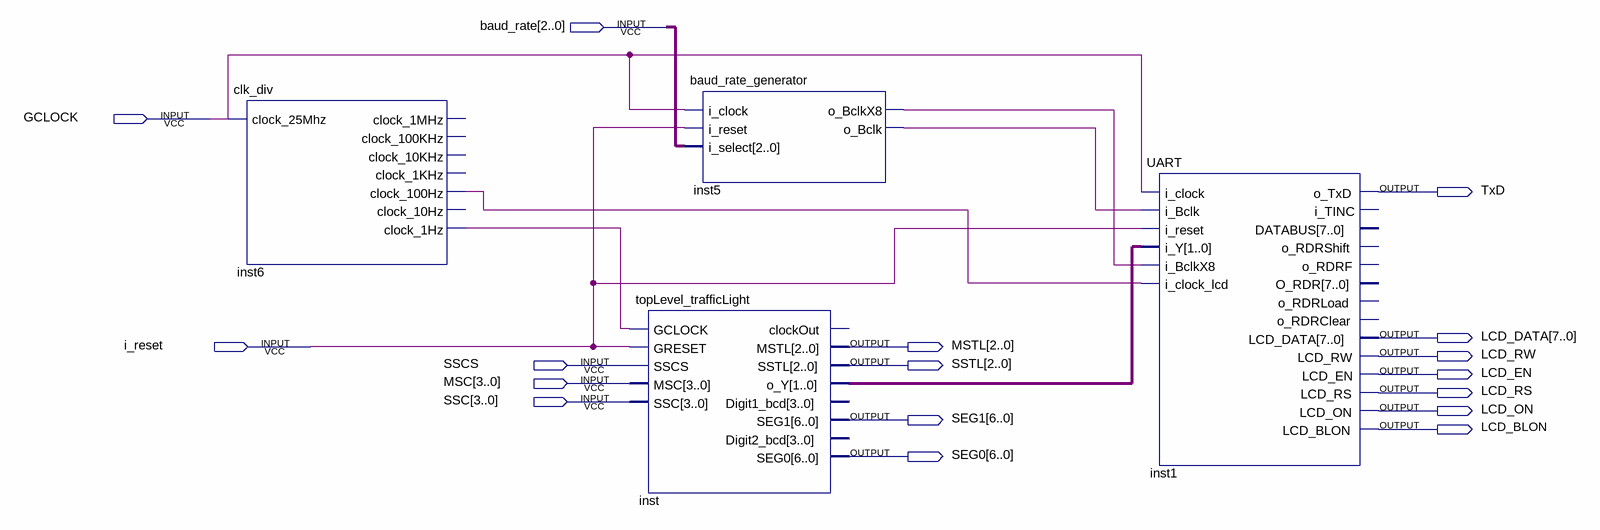
[diagram p0: schematic sheet]
// Quartus schematic top.bdf as structural Verilog: 4 symbols, 17 pins
module top (
  input  [2:0] baud_rate,
  input  GCLOCK,
  input  i_reset,
  input  SSCS,
  input  [3:0] MSC,
  input  [3:0] SSC,
  output TxD,
  output [7:0] LCD_DATA,
  output [2:0] MSTL,
  output LCD_RW,
  output [2:0] SSTL,
  output LCD_EN,
  output LCD_RS,
  output LCD_ON,
  output [6:0] SEG1,
  output LCD_BLON,
  output [6:0] SEG0
);

  wire inst5_o_bclk, inst5_o_bclkx8, inst6_clock_1hz, inst6_clock_100hz;
  wire [1:0] inst_o_y;

  clk_div inst6 (
    .clock_25Mhz(GCLOCK), .clock_100Hz(inst6_clock_100hz), .clock_1Hz(inst6_clock_1hz));  // open: clock_1MHz, clock_100KHz, clock_10KHz, clock_1KHz, clock_10Hz
  topLevel_trafficLight inst (
    .GCLOCK(inst6_clock_1hz), .GRESET(i_reset), .SSCS(SSCS), .MSC(MSC), .SSC(SSC), .MSTL(MSTL), .SSTL(SSTL),
    .o_Y(inst_o_y), .SEG1(SEG1), .SEG0(SEG0));  // open: clockOut, Digit1_bcd, Digit2_bcd
  baud_rate_generator inst5 (
    .i_clock(GCLOCK), .i_reset(i_reset), .i_select(baud_rate), .o_BclkX8(inst5_o_bclkx8),
    .o_Bclk(inst5_o_bclk));
  UART inst1 (
    .i_clock(GCLOCK), .i_Bclk(inst5_o_bclk), .i_reset(i_reset), .i_Y(inst_o_y), .i_BclkX8(inst5_o_bclkx8),
    .i_clock_lcd(inst6_clock_100hz), .o_TxD(TxD), .LCD_DATA(LCD_DATA), .LCD_RW(LCD_RW), .LCD_EN(LCD_EN),
    .LCD_RS(LCD_RS), .LCD_ON(LCD_ON), .LCD_BLON(LCD_BLON));  // open: i_TINC, DATABUS, o_RDRShift, o_RDRF, O_RDR, o_RDRLoad, o_RDRClear
endmodule
